# Altium schematic sheet Power_Supplies.SchDoc
size A4; SheetNumber: 7
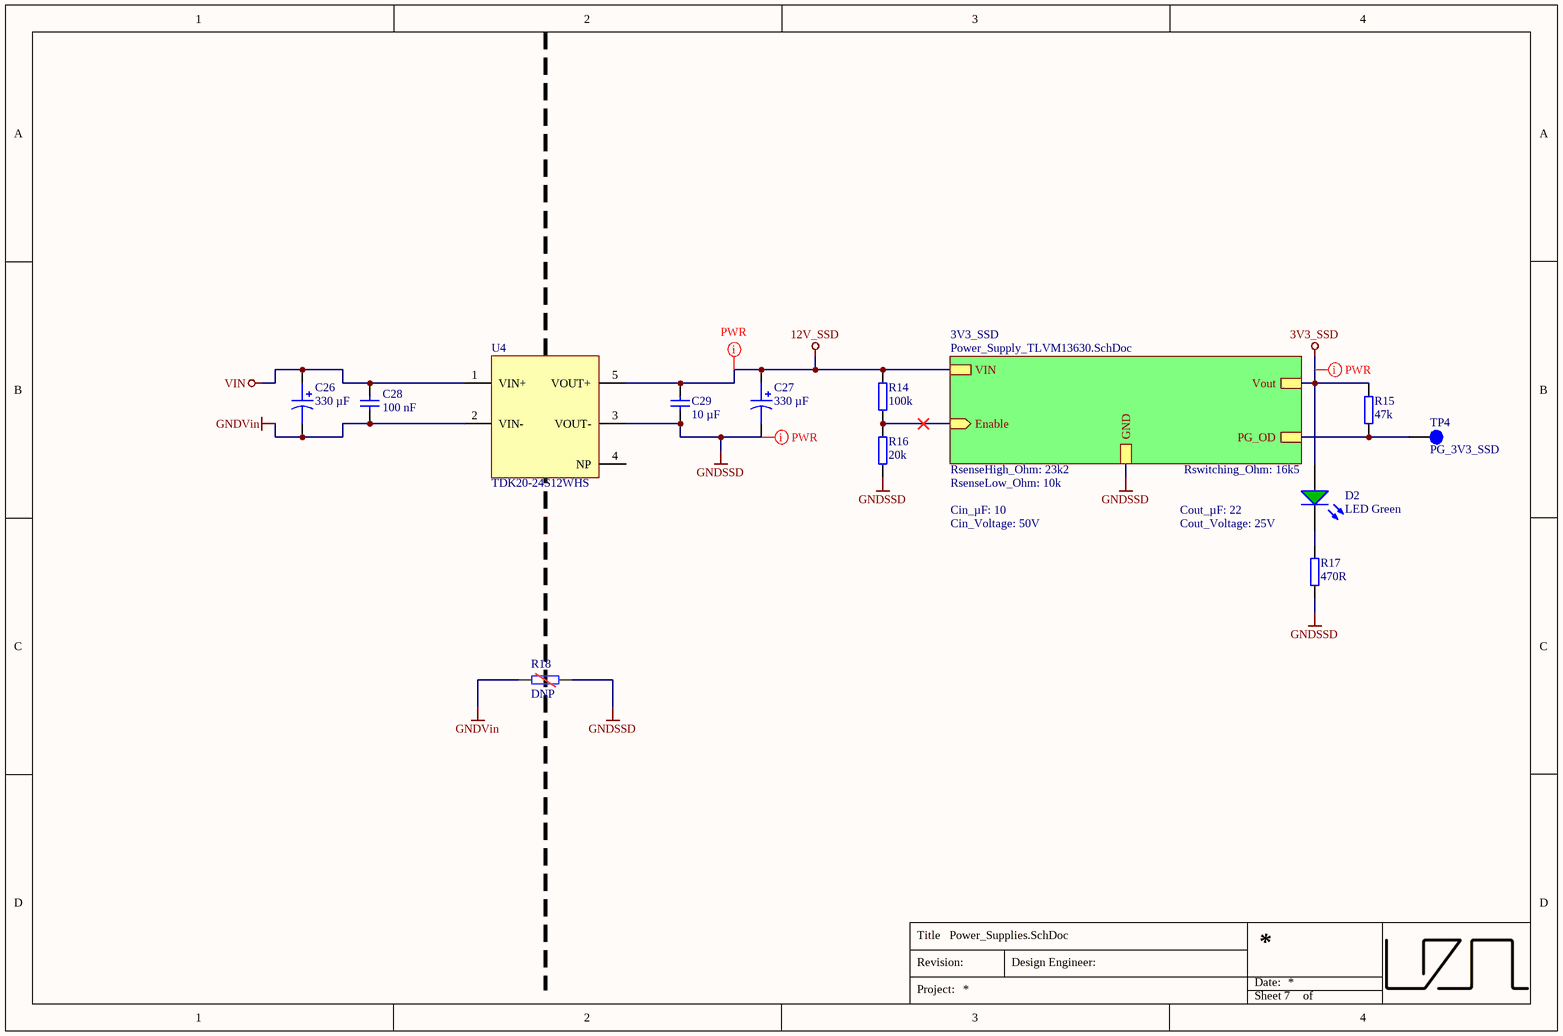
[diagram p0: Power_Supplies.SchDoc]

## Parts
C26  330 µF  [SM_RADIAL_10mm]
C27  330 µF  [SM_RADIAL_10mm]
C28  100 nF  [C_0603_TE]
C29  10 µF  [C_1206_TE]
D2  LED Green  [WL-SMCW_0603]
R14  100k  [R_0603_TE]
R15  47k  [R_0603_TE]
R16  20k  [R_0603_TE]
R17  470R  [R_0603_TE]
R18  DNP  [R_1206_TE-DNP]  (no BOM)
TP4  PG_3V3_SSD  [TP_1mm]  (no BOM)
U4  TDK20-24S12WHS  [TDKxx-yySzzS_25.4x25.4]

## Sub-sheets
3V3_SSD = Power_Supply_TLVM13630.SchDoc: Vout, Enable (in), VIN, GND, PG_OD  | RsenseHigh_Ohm: 23k2; RsenseLow_Ohm: 10k; Rswitching_Ohm: 16k5; Cin_µF: 10; Cin_Voltage: 50V; Cin_Technology: X7R; Cout_µF: 22; Cout_Voltage: 25V; Cout_Technology: X7R; SubSheet_SheetNumber: 8; Output_V: 3.3

## Nets
3V3_SSD: D2.2(A) R15.1 ; sheet 3V3_SSD/Vout
12V_SSD: C27.1 C29.2 R14.2 U4.5(VOUT+) ; sheet 3V3_SSD/VIN
GNDSSD: C27.2 C29.1 R16.1 R17.1 R18.1 U4.3(VOUT-) ; sheet 3V3_SSD/GND
GNDVin: C26.2 C28.2 R18.2 U4.2(VIN-)
VIN: C26.1 C28.1 U4.1(VIN+)
NetD2_1: D2.1(K) R17.2
NetR14_1: R14.1 R16.2 ; sheet 3V3_SSD/Enable
NetR15_2: R15.2 TP4.1 ; sheet 3V3_SSD/PG_OD

Not connected (* = marked no-connect by the designer): U4 4(NP)

## Layout directives
net class PWR: 3V3_SSD, 12V_SSD, GNDSSD

## Notes on the sheet
- Title
- Revision:
- Design Engineer:
- Date:
- Project:
- Sheet
- of

## Library data of the parts
C26 C27 = EEEFT1H331GP: Aluminium Electrolytic Capacitors - SMD 330uF 50V; Manufacturer: Panasonic; Tolerance: 20 %; Voltage Rating: 50 VDC; Created from: FRosner; Manufacturer Part Number: EEEFT1H331GP; PartID: 163; Created On: 05/09/2024 09:08:02; ComponentLink1Description: Datasheet; ComponentLink1URL: https://www.mouser.de/datasheet/2/315/ABA0000C1240-1130326.pdf; Component Type: Aluminium Electrolytic; Device Package: 10 mm; Last Updated: 19/02/2025 08:53:22; Mounting Type: SMD; Operating Temperature: -55 to +105°C; Series: FT; Supplier 1: Mouser; Supplier Part Number 1: 667-EEE-FT1H331GP; Supplier 2: LCSC; Supplier Part Number 2: C542207; Type: Capacitor; Value: 330 µF; Live Cycle Status: 1; LCSC Part Number: C542207
C28 = UZgen_C_0603_100nF_50V_X7R: Generic capacitor; Manufacturer: UZgen; Tolerance: 10 %; Voltage: 50V; Created from: AGeiger; Technology: X7R; Value: 100 nF; Manufacturer Part Number: UZgen_C_0603_100nF_50V_X7R; PartID: 1; Created On: 02/07/2024 14:42:23; Device Package: 0603; Mounting Type: SMD; Last Updated: 08/08/2024 15:01:15
C29 = UZgen_C_1206_10uF_50V_X7R: Generic capacitor; Manufacturer: UZgen; Tolerance: 10 %; Created from: MGeier; Voltage: 50V; Manufacturer Part Number: UZgen_C_1206_10uF_50V_X7R; PartID: 5807; Created On: 20/03/2025 14:05:00; Device Package: 1206; Last Updated: 20/03/2025 14:05:00; Mounting Type: SMD; Value: 10 µF; Technology: X7R
D2 = UZgen_LED_0603_Green: Standard LEDs - SMD 0603 green; Manufacturer: UZgen; Created from: UZgenTool; Manufacturer Part Number: UZgen_LED_0603_Green; PartID: 21; Created On: 09/09/2024 10:45:01; ComponentLink1Description: N/A; ComponentLink1URL: N/A; Component Type: LED Diode; Device Package: 0603; Last Updated: 09/09/2024 10:45:01; Mounting Type: SMD; Supplier 1: LCSC; Supplier Part Number 1: =LCSC Part Number; Type: Standard; Value: LED Green; Live Cycle Status: 1; Stock number: not stored; Color: green
R14 = UZgen_R_0603_100k: Generic resistor; Manufacturer: UZgen; Tolerance: 1 %; Created from: UZgenTool; Manufacturer Part Number: UZgen_R_0603_100k; PartID: 268; Created On: 02/07/2024 17:29:50; Value: 100k; Device Package: 0603; Mounting Type: SMD; Last Updated: 02/07/2024 17:29:50
R15 = UZgen_R_0603_47k: Generic resistor; Manufacturer: UZgen; Tolerance: 1 %; Created from: UZgenTool; Manufacturer Part Number: UZgen_R_0603_47k; PartID: 260; Created On: 02/07/2024 17:29:50; Value: 47k; Device Package: 0603; Mounting Type: SMD; Last Updated: 02/07/2024 17:29:50
R16 = UZgen_R_0603_20k: Generic resistor; Manufacturer: UZgen; Tolerance: 1 %; Created from: UZgenTool; Manufacturer Part Number: UZgen_R_0603_20k; PartID: 251; Created On: 02/07/2024 17:29:50; Value: 20k; Device Package: 0603; Mounting Type: SMD; Last Updated: 02/07/2024 17:29:50
R17 = UZgen_R_0603_470R: Generic resistor; Manufacturer: UZgen; Tolerance: 1 %; Created from: UZgenTool; Manufacturer Part Number: UZgen_R_0603_470R; PartID: 213; Created On: 02/07/2024 17:29:49; Value: 470R; Device Package: 0603; Mounting Type: SMD; Last Updated: 02/07/2024 17:29:49
R18 = UZgen_R_1206_DNP: Generic resistor (DNP); Manufacturer: UZgen; Created from: UZgenTool; Manufacturer Part Number: UZgen_R_1206_DNP; PartID: 595; Created On: 25/03/2025 14:26:15; Value: DNP; Device Package: 1206; Tolerance: -; Mounting Type: SMD; Last Updated: 02/04/2025 19:05:00
TP4 = NULL: Testpoint 1mm; Manufacturer Part Number: NULL; Created from: AGeiger; Created: 2018_06_25_AGeiger; Value: PG_3V3_SSD; PartID: 9; Created On: 20/09/2022 13:14:57; Component Type: Testpoint; Last Updated: 20/09/2022 13:15:39; Manufacturer: NULL; Supplier 1: NULL; Supplier Part Number 1: NULL; Type: Testpoint; Live Cycle Status: 1
U4 = TDK20-24S12WHS: 9-36V to 12V 1.67A / Plugin,25.4x25.4mm Isolated Power Modules ROHS; Manufacturer: TDPOWER; Created from: MGeier; Manufacturer Part Number: TDK20-24S12WHS; PartID: 12; Created On: 24/02/2025 16:03:45; ComponentLink1Description: Datasheet; ComponentLink1URL: https://wmsc.lcsc.com/wmsc/upload/file/pdf/v2/lcsc/2403202025_TDPOWER-TDK20-24S12WHS_C7494352.pdf; Component Type: Isolated DC/DC; Device Package: 25.4x25.4mm²; Last Updated: 24/02/2025 16:03:45; Mounting Type: THT; Operating Temperature: -40 - 85 °C; Supplier 1: LCSC; Supplier Part Number 1: C7494352; Type: Isolated DC/DC; Live Cycle Status: 1; LCSC Part Number: C7494352; Stock number: not stored